# Altium schematic sheet 3.3V_Converter.SchDoc
size A; SheetNumber: 2; SheetTotal: 8
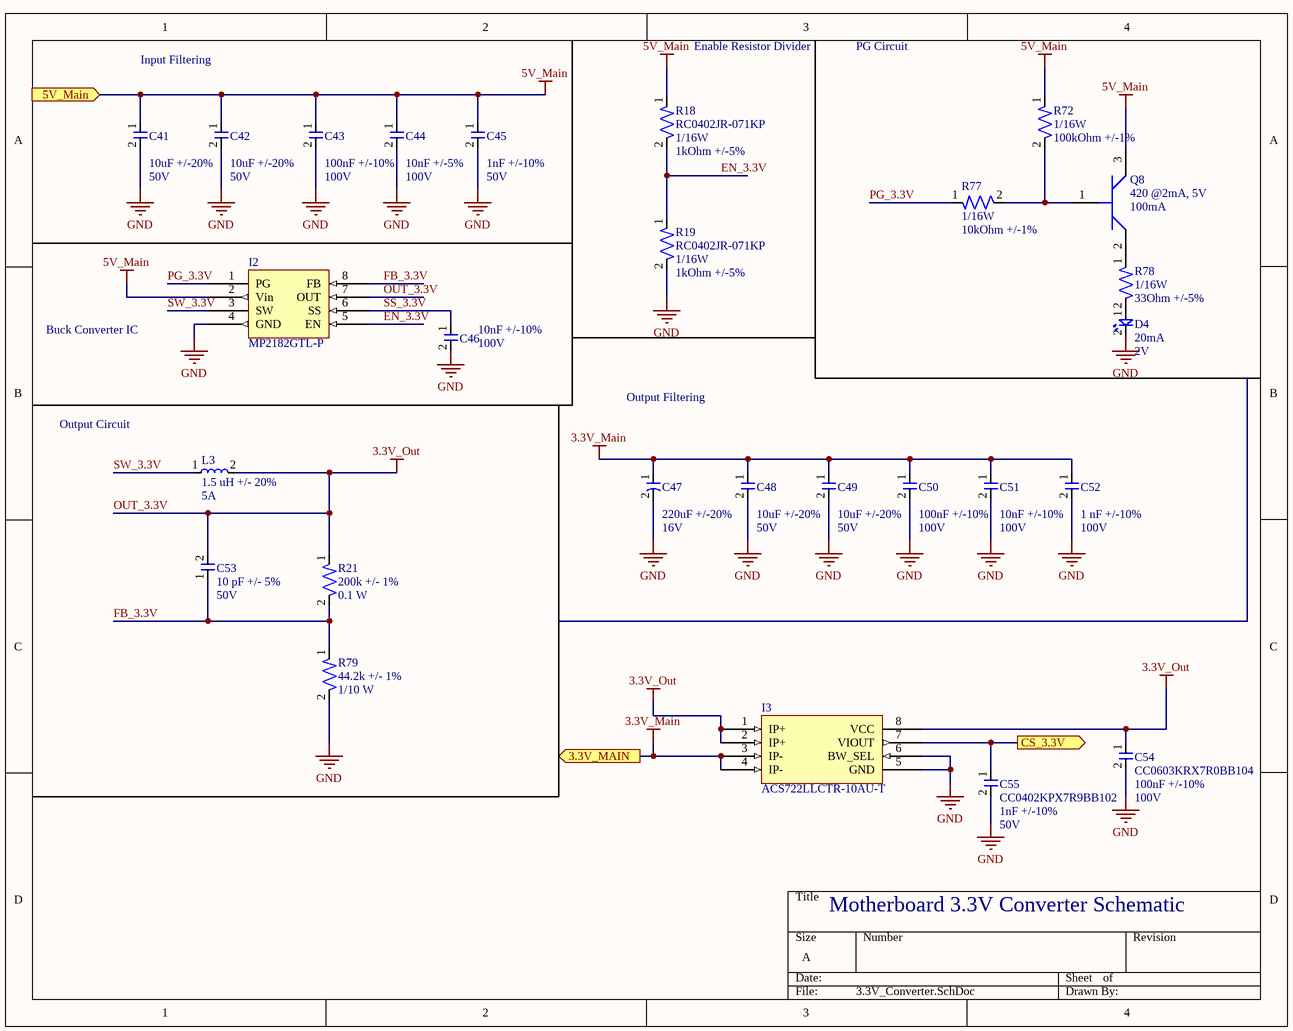
[diagram p0: 3.3V_Converter.SchDoc]

## Parts
C41  Capacitance: 10uF +/-20%  Voltage Rating: 50V  [CAP-1206]  (hidden comment: CL31B106KBHNNNE)
C42  Capacitance: 10uF +/-20%  Voltage Rating: 50V  [CAP-1206]  (hidden comment: CL31B106KBHNNNE)
C43  Capacitance: 100nF +/-10%  Voltage Rating: 100V  [CAP-0603]  (hidden comment: CC0603KRX7R0BB104)
C44  Capacitance: 10nF +/-5%  Voltage Rating: 100V  [CAP-0603]  (hidden comment: C1608C0G2A103J080AC)
C45  Capacitance: 1nF +/-10%  Voltage Rating: 50V  [CAP-0402]  (hidden comment: CC0402KPX7R9BB102)
C46  Capacitance: 10nF +/-10%  Voltage Rating: 100V  [CAP-0402]  (hidden comment: CC0402KRX7R0BB103)
C47  Capacitance: 220uF +/-20%  Voltage Rating: 16V  [ELEC-220U-0001]  (hidden comment: UUD1C221MCL1GS)
C48  Capacitance: 10uF +/-20%  Voltage Rating: 50V  [CAP-1206]  (hidden comment: CL31B106KBHNNNE)
C49  Capacitance: 10uF +/-20%  Voltage Rating: 50V  [CAP-1206]  (hidden comment: CL31B106KBHNNNE)
C50  Capacitance: 100nF +/-10%  Voltage Rating: 100V  [CAP-0603]  (hidden comment: CC0603KRX7R0BB104)
C51  Capacitance: 10nF +/-10%  Voltage Rating: 100V  [CAP-0402]  (hidden comment: CC0402KRX7R0BB103)
C52  Capacitance: 1 nF +/-10%  Voltage: 100V  [CAP-0603]  (hidden comment: CAP-1N-0001)
C53  Capacitance: 10 pF +/- 5%  Voltage Rating: 50V  [CAP-0603]  (hidden comment: 0603N100J500CT)
C54  CC0603KRX7R0BB104  Capacitance: 100nF +/-10%  Voltage Rating: 100V  [CAP-0603]
C55  CC0402KPX7R9BB102  Capacitance: 1nF +/-10%  Voltage Rating: 50V  [CAP-0402]
D4  Current Rating: 20mA  Vf: 2V  [LED-0603]  (hidden comment: 150060AS75000)
I2  MP2182GTL-P  [IC-SOT583]
I3  ACS722LLCTR-10AU-T  [IC-CURRENT-0001]
L3  Inductance: 1.5 uH +/- 20%  Saturation Current: 5A  [IND-1210]  (hidden comment: SRP3212-1R5M)
Q8  hFE: 420 @2mA, 5V  Ic: 100mA  [NPN-420-0001]  (hidden comment: BC847C,235)
R18  RC0402JR-071KP  Power Rating: 1/16W  Resistance: 1kOhm +/-5%  [RES-0402]
R19  RC0402JR-071KP  Power Rating: 1/16W  Resistance: 1kOhm +/-5%  [RES-0402]
R21  Resistance: 200k +/- 1%  Power Rating: 0.1 W  [RES-0603]  (hidden comment: ERJ-3EKF2003V)
R72  Power Rating: 1/16W  Resistance: 100kOhm +/-1%  [RES-0402]  (hidden comment: AF0402FR-07100KL)
R77  Power Rating: 1/16W  Resistance: 10kOhm +/-1%  [RES-0402]  (hidden comment: RC0402FR-0710KL)
R78  Power Rating: 1/16W  Resistance: 33Ohm +/-5%  [RES-0402]  (hidden comment: RC0402JR-0733RP)
R79  Resistance: 44.2k +/- 1%  Power: 1/10 W  [RES-0603]  (hidden comment: RMCF0603FT44K2)

## Ports
3.3V_MAIN (out), 5V_Main (in), CS_3.3V (out)

## Nets
3.3V_Main: C47.1 C48.1 C49.1 C50.1 C51.1 C52.1 I3.3(IP-) I3.4(IP-) ; port 3.3V_MAIN
5V_Main: C41.1 C42.1 C43.1 C44.1 C45.1 I2.2(Vin) Q8.3 R18.1 R72.1 ; port 5V_Main
GND: C41.2 C42.2 C43.2 C44.2 C45.2 C46.2 C47.2 C48.2 C49.2 C50.2 C51.2 C52.2 C54.2 C55.2 D4.2 I2.4(GND) I3.5(GND) I3.6(BW_SEL) R19.2 R79.2
OUT_3.3V: C53.2 C54.1 I2.7(OUT) I3.1(IP+) I3.2(IP+) I3.8(VCC) L3.2 R21.1  [also labelled 3.3V_Out]
CS_3.3V: C55.1 I3.7(VIOUT) ; port CS_3.3V
EN_3.3V: I2.5(EN) R18.2 R19.1
FB_3.3V: C53.1 I2.8(FB) R21.2 R79.1
PG_3.3V: I2.1(PG) R77.1
SS_3.3V: C46.1 I2.6(SS)
SW_3.3V: I2.3(SW) L3.1
NetD4_1: D4.1 R78.2
NetQ8_1: Q8.1 R72.2 R77.2
NetQ8_2: Q8.2 R78.1

## Notes on the sheet
- Input Filtering
- Enable Resistor Divider
- PG Circuit
- Buck Converter IC
- Output Circuit
- Output Filtering
- Motherboard 3.3V Converter Schematic

## Library data of the parts
C41 C42 C48 C49 = CAP-10U-0001: 10 µF ±10% 50V Ceramic Capacitor X7R 1206 (3216 Metric); Manufacturer: Samsung Electro-Mechanics; Assembled?: no; Manufacturer Part Number: CL31B106KBHNNNE; Temperature Coefficient: X7R; Package Size: 1206
C43 C50 C54 = CAP-100N-0001: CAP CER 0.1UF 100V X7R 0603; Manufacturer: YAGEO; Assembled?: no; Manufacturer Part Number: CC0603KRX7R0BB104; Temperature Coefficient: X7R; Package Size: 0603
C44 = CAP-10N-0002: CAP CER 10000PF 100V C0G 0603; Manufacturer: TDK Corporation; Temperature Coefficient: C0G/NP0; Assembled?: no; Manufacturer Part Number: C1608C0G2A103J080AC; Package Size: 0603
C45 C55 = CAP-1N-0002: 1000 pF ±10% 50V Ceramic Capacitor X7R 0402 (1005 Metric); Manufacturer: YAGEO; Assembled?: no; Manufacturer Part Number: CC0402KPX7R9BB102; Temperature Coefficient: X7R; Package Size: 0402
C46 C51 = CAP-10N-0001: 10000 pF ±10% 100V Ceramic Capacitor X7R 0402 (1005 Metric); Manufacturer: YAGEO; Assembled?: no; Manufacturer Part Number: CC0402KRX7R0BB103; Temperature Coefficient: X7R; Package Size: 0402
C47 = ELEC-220U-0001: 220 µF 16 V Aluminum Electrolytic Capacitors Radial, Can - SMD 2000 Hrs @ 105°C; Manufacturer: Nichicon; Assembled?: no; Manufacturer Part Number: UUD1C221MCL1GS
C52 = CAP-1N-0001: 1000 pF ±10% 100V Ceramic Capacitor X7R 0603 (1608 Metric)
C53 = CAP-10P-0001: 10 pF ±5% 50V Ceramic Capacitor C0G, NP0 0603 (1608 Metric); Manufacturer: Walshin Technology Corporation; Assembled?: Yes; Manufacturer Part Number: 0603N100J500CT; Temperature Coefficient: C0G, NP0; Package Size: 0603
D4 = LED_Amber_0001: CAP CER 0.1UF 100V X7R 0603; Manufacturer: Wurth Electronik; Assembled?: no; Color: Amber; Manufacturer Part Number: 150060AS75000; Package Size: 0603
I2 = IC-BUCK-0003: Buck Switching Regulator IC Positive Adjustable 0.6V 1 Output 2A SOT-583; Manufacturer: Monolithic Power Systems; Assembled?: no; VCC-Max: 5.5V; VCC-Min: 2.5V; Vout-Tolerance: +/-1%; Fsw: 1.2MHz; Manufacturer Part Number: MP2182GTL-P; Type: Buck; Package: SOT-583; Vout-Max: 5.5V; Vout-Min: 0.6V; Output Current-Max: 2A
I3 = IC-CURRENT-0001: Current Sensor 10A 1 Channel Hall Effect, Open Loop Unidirectional 8-SOIC (0.154", 3.90mm Width)
L3 = PWRIND-1.5U-0001: 1.5 µH Shielded Drum Core, Wirewound Inductor 4.4 A 53mOhm Max 1210 (3225 Metric); Manufacturer: Bourns Inc.; Assembled?: Yes; Manufacturer Part Number: SRP3212-1R5M; Package Size: 1210; DC Resistance: 53 mOhm
Q8 = BJT-420-0001: Bipolar (BJT) Transistor NPN 45 V 100 mA 100MHz 250 mW Surface Mount TO-236AB; VCEO: 45V; Transistor type: NPN; Package: TO-236AB
R18 R19 = RES-1K-0001: RES SMD 1K OHM 5% 1/16W 0402; Manufacturer: YAGEO; Assembled?: no; Manufacturer Part Number: RC0402JR-071KP; Package Size: 0402
R21 = RES-200K-0001: 200 kOhms ±1% 0.1W, 1/10W Chip Resistor 0603 (1608 Metric) Automotive AEC-Q200 Thick Film; Manufacturer: Panasonic Electronic Components; Assembled?: Yes; MFP: ERJ-3EKF2003V; Package SIze: 0603
R72 = RES-100K-0001: 100 kOhms ±1% 0.063W, 1/16W Chip Resistor 0402 (1005 Metric) Anti-Sulfur, Automotive AEC-Q200 Thick Film; Manufacturer: YAGEO; Assembled?: no; Manufacturer Part Number: AF0402FR-07100KL; Package Size: 0402
R77 = RES-10K-0001: RES 10K OHM 1% 1/16W 0402; Manufacturer: YAGEO; Assembled?: no; Manufacturer Part Number: RC0402FR-0710KL; Package Size: 0402
R78 = RES-33-0001: RES SMD 33 OHM 5% 1/16W 0402; Manufacturer: YAGEO; Assembled?: no; Manufacturer Part Number: RC0402JR-0733RP; Package Size: 0402
R79 = RES-44.2K-0001: 44.2 kOhms ±1% 0.1W, 1/10W Chip Resistor 0603 (1608 Metric) Automotive AEC-Q200 Thick Film